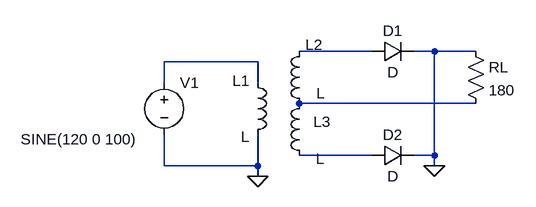
[diagram p0: schematic lab1.asc]
lab1.asc, the LTspice schematic file:
Version 4
SHEET 1 880 680
WIRE 336 80 224 80
WIRE 432 80 400 80
WIRE 496 80 432 80
WIRE 160 96 16 96
WIRE 16 128 16 96
WIRE 160 128 160 96
WIRE 496 160 224 160
WIRE 336 240 224 240
WIRE 432 240 432 80
WIRE 432 240 400 240
WIRE 16 256 16 208
WIRE 160 256 160 208
WIRE 160 256 16 256
WIRE 432 256 432 240
WIRE 160 272 160 256
FLAG 160 272 0
FLAG 432 256 0
SYMBOL voltage 16 112 R0
WINDOW 3 -221 103 Left 2
WINDOW 123 0 0 Left 0
WINDOW 39 0 0 Left 0
SYMATTR Value SINE(120 0 100)
SYMATTR InstName V1
SYMBOL ind 144 112 R0
WINDOW 0 -23 13 Left 2
WINDOW 3 -10 99 Left 2
SYMATTR InstName L1
SYMBOL ind 240 64 M0
WINDOW 0 -20 6 Left 2
WINDOW 3 -24 80 Left 2
SYMATTR InstName L2
SYMBOL ind 240 144 M0
WINDOW 0 -33 44 Left 2
WINDOW 3 -23 101 Left 2
SYMATTR InstName L3
SYMBOL diode 336 96 R270
WINDOW 0 32 32 VTop 2
WINDOW 3 0 32 VBottom 2
SYMATTR InstName D1
SYMBOL diode 336 256 R270
WINDOW 0 32 32 VTop 2
WINDOW 3 0 32 VBottom 2
SYMATTR InstName D2
SYMBOL res 480 64 R0
SYMATTR InstName RL
SYMATTR Value 180

The netlist it stands for:
* lab1.asc
V1 N002 0 SINE(120 0 100)
L1 N002 0 L
L2 N001 N003 L
L3 N003 N004 L
D1 N001 0 D
D2 N004 0 D
RL 0 N003 180
.model D D
.lib standard.dio
.backanno
.end